# Altium schematic sheet TDA2030音频功率放大器总线子线.SchDoc
size A4
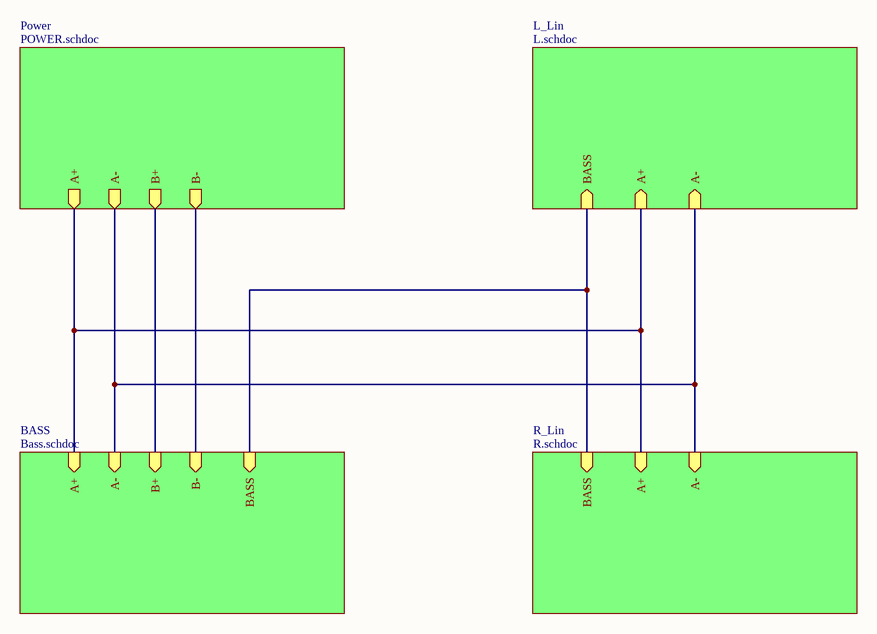
[diagram p0: TDA2030音频功率放大器总线子线.SchDoc]

## Sub-sheets
BASS = Bass.schdoc: B+ (in), B- (in), A+ (in), A- (in)
L_Lin = L.schdoc: A+ (in), A- (in), BASS (in)
Power = POWER.schdoc: A+ (out), A- (out), B+ (out), B- (out)
R_Lin = R.schdoc: BASS (in), A- (in), A+ (in), BASS (in)

## Nets
(unnamed): sheet Power/A+, sheet L_Lin/A+, sheet BASS/A+, sheet R_Lin/A+
(unnamed): sheet Power/A-, sheet L_Lin/A-, sheet BASS/A-, sheet R_Lin/A-
(unnamed): sheet Power/B+, sheet BASS/B+
(unnamed): sheet Power/B-, sheet BASS/B-
(unnamed): sheet L_Lin/BASS, sheet R_Lin/BASS, sheet R_Lin/BASS